# EasyEDA Pro project 二版平衡车pcb.epro, board PCB4
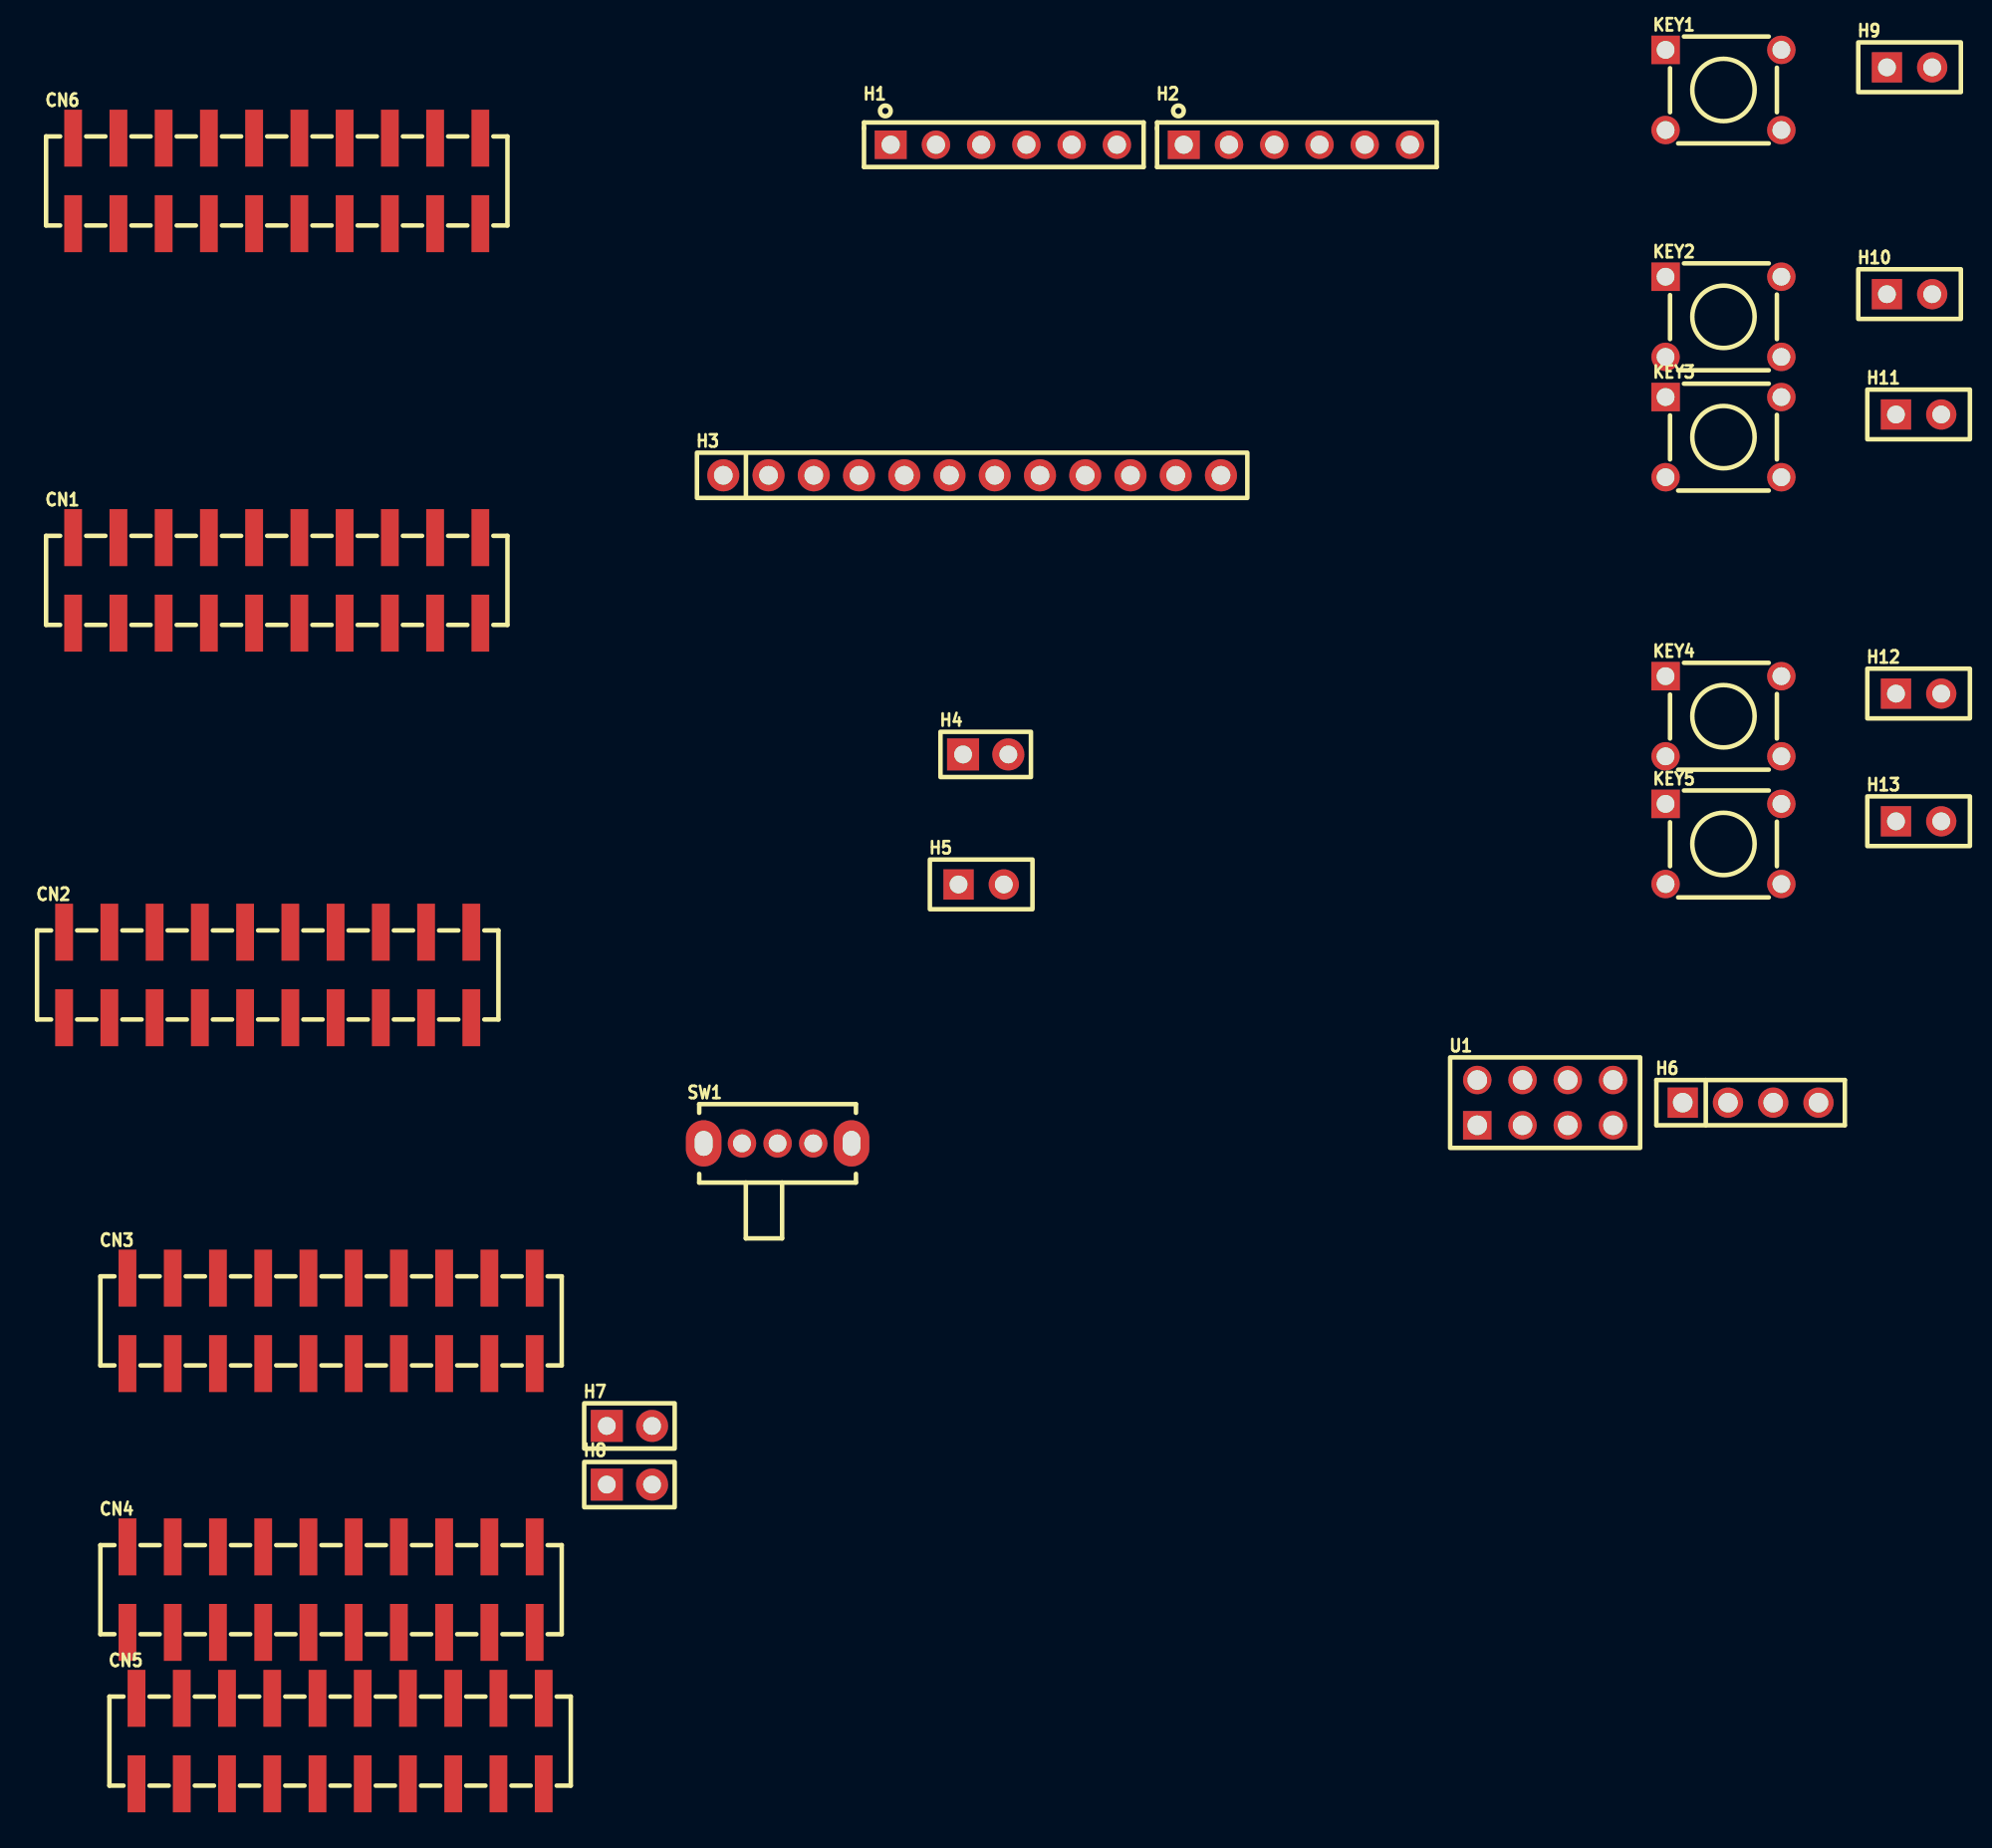
[diagram p8: board, top side]
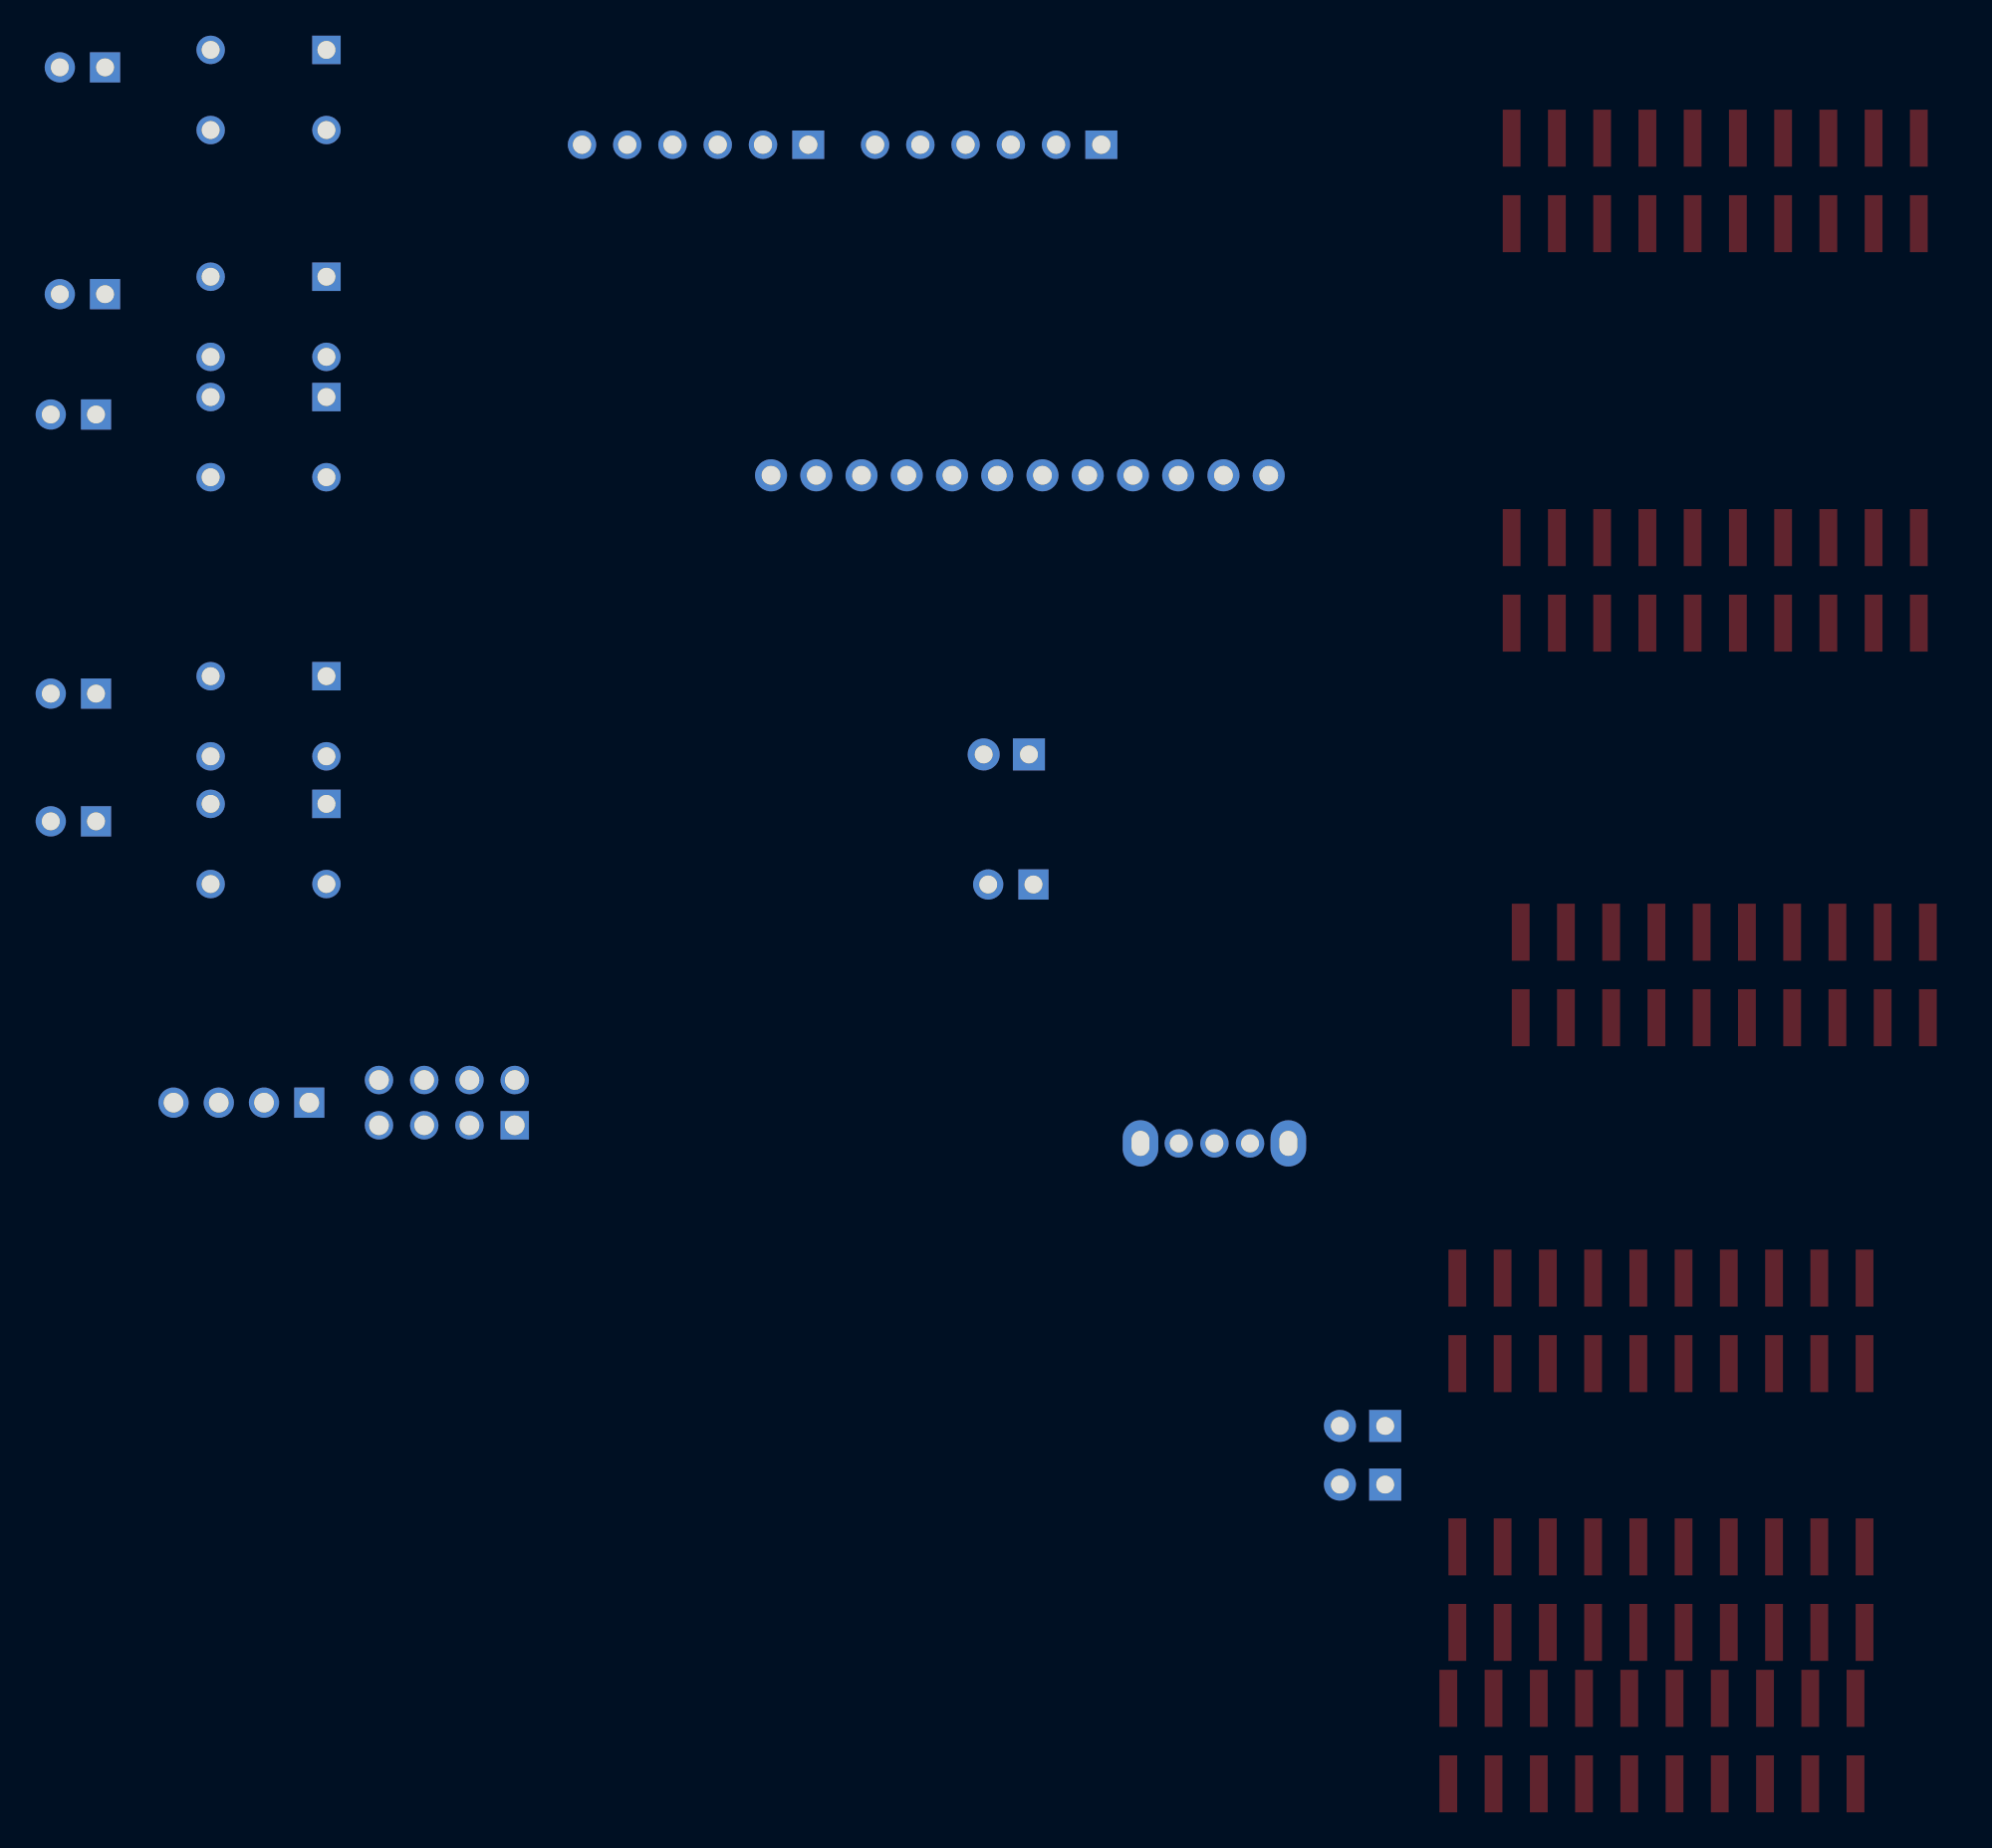
[diagram p9: board, bottom side, seen from below]

No outline. copper layers: Top Layer, Bottom Layer. Coordinates in mm from the lowest, leftmost part position.
Stack: Top Layer 0.035mm / Dielectric1 1.51mm FR4 er 4.5 / Bottom Layer 0.035mm

## Design rules (mm)
template: JLCPCB Capability(Two Layers Board)
spacing copperThickness1oz (default): track to track 0.102, other pairs 0.152 to 0.3
spacing copperThickness2oz: track to track 0.203, other pairs 0.152 to 0.3
track width copperThickness1oz (default): min 0.127, default 0.254, max 2.54
track width copperThickness2oz: min 0.203, default 0.254, max 2.54
differential pair differentialPair (default): width min 0.127, default 0.254, max 2.54; gap min 0.152, default 0.152
via viaSize (default): diameter min 0.5, default 0.61, max 10; hole min 0.3, default 0.305, max 6.3

## Placement (name value [footprint] x y rotation side)
CN1  PM254-2-10-S-8.5  [HDR-SMD_20P-P2.54-V-F-R2-C10-S2.54-LS7.1]  0.51 65.15 0 top
CN2  PM254-2-10-S-8.5  [HDR-SMD_20P-P2.54-V-F-R2-C10-S2.54-LS7.1]  0 43 0 top
CN3  PM254-2-10-S-8.5  [HDR-SMD_20P-P2.54-V-F-R2-C10-S2.54-LS7.1]  3.56 23.59 0 top
CN4  PM254-2-10-S-8.5  [HDR-SMD_20P-P2.54-V-F-R2-C10-S2.54-LS7.1]  3.56 8.5 0 top
CN5  PM254-2-10-S-8.5  [HDR-SMD_20P-P2.54-V-F-R2-C10-S2.54-LS7.1]  4.06 0 0 top
CN6  PM254-2-10-S-8.5  [HDR-SMD_20P-P2.54-V-F-R2-C10-S2.54-LS7.1]  0.51 87.58 0 top
H1  -  [HDR-TH_6P-P2.54-V-F]  41.32 89.61 0 top
H2  -  [HDR-TH_6P-P2.54-V-F]  57.78 89.61 0 top
H3  -  [HDR-TH_12P-P2.54-V-F]  39.55 71.05 0 top
H4  -  [HDR-TH_2P-P2.54-V-M-1]  40.31 55.38 0 top
H5  -  [HDR-TH_2P-P2.54-V-F]  40.06 48.08 0 top
H6  -  [HDR-TH_4P-P2.54-V-F]  83.25 35.84 0 top
H7  -  [HDR-TH_2P-P2.54-V-M-1]  20.31 17.69 0 top
H8  -  [HDR-TH_2P-P2.54-V-M-1]  20.31 14.4 0 top
H9  -  [HDR-TH_2P-P2.54-V-F]  92.18 93.95 0 top
H10  -  [HDR-TH_2P-P2.54-V-F]  92.18 81.22 0 top
H11  -  [HDR-TH_2P-P2.54-V-F]  92.68 74.46 0 top
H12  -  [HDR-TH_2P-P2.54-V-F]  92.68 58.8 0 top
H13  -  [HDR-TH_2P-P2.54-V-F]  92.68 51.63 0 top
KEY1  AN6*6  [KEY-TH_4P-L6.0-W6.0-P6.50-LS4.5]  81.73 92.68 0 top
KEY2  AN6*6  [KEY-TH_4P-L6.0-W6.0-P6.50-LS4.5]  81.73 79.95 0 top
KEY3  AN6*6  [KEY-TH_4P-L6.0-W6.0-P6.50-LS4.5]  81.73 73.19 0 top
KEY4  AN6*6  [KEY-TH_4P-L6.0-W6.0-P6.50-LS4.5]  81.73 57.53 0 top
KEY5  AN6*6  [KEY-TH_4P-L6.0-W6.0-P6.50-LS4.5]  81.73 50.36 0 top
SW1  SK12D07VG3  [SW-TH_SK12D07VG3]  28.62 33.55 0 top
U1  2.54-2*4  [HDR-TH_8P-P2.54-V-F-R2-C4-S2.54]  71.72 35.84 0 top

## Footprints (pads in the part's own frame, mm; a bottom-side part is the same pattern mirrored in y, then rotated)
HDR-SMD_20P-P2.54-V-F-R2-C10-S2.54-LS7.1
  rect 1x3.2 smd: 1(-11.43,-2.4) 2(-11.43,2.4) 3(-8.89,-2.4) 4(-8.89,2.4) 5(-6.35,-2.4) 6(-6.35,2.4) 7(-3.81,-2.4) 8(-3.81,2.4) 9(-1.27,-2.4) 10(-1.27,2.4) 11(1.27,-2.4) 12(1.27,2.4) 13(3.81,-2.4) 14(3.81,2.4) 15(6.35,-2.4) 16(6.35,2.4) 17(8.89,-2.4) 18(8.89,2.4) 19(11.43,-2.4) 20(11.43,2.4)
HDR-TH_2P-P2.54-V-F
  rect 1.7x1.7 hole 1: 1(-1.27,0)
  round 1.7 hole 1: 2(1.27,0)
HDR-TH_2P-P2.54-V-M-1
  rect 1.8x1.8 hole 1: 1(-1.27,0)
  round 1.8 hole 1: 2(1.27,0)
HDR-TH_4P-P2.54-V-F
  rect 1.7x1.7 hole 1.1: 1(-3.81,0)
  round 1.7 hole 1.1: 2(-1.27,0) 3(1.27,0) 4(3.81,0)
HDR-TH_6P-P2.54-V-F
  rect 1.8x1.6 hole 1.02: 1(-6.35,0)
  round 1.6 hole 1.02: 2(-3.81,0) 3(-1.27,0) 4(1.27,0) 5(3.81,0) 6(6.35,0)
HDR-TH_8P-P2.54-V-F-R2-C4-S2.54
  rect 1.6x1.6 hole 1.1: 1(-3.81,-1.27)
  round 1.6 hole 1.1: 2(-3.81,1.27) 3(-1.27,-1.27) 4(-1.27,1.27) 5(1.27,-1.27) 6(1.27,1.27) 7(3.81,-1.27) 8(3.81,1.27)
HDR-TH_12P-P2.54-V-F
  round 1.8 hole 1.05: 1(-13.97,0) 2(-11.43,0) 3(-8.89,0) 4(-6.35,0) 5(-3.81,0) 6(-1.27,0) 7(1.27,0) 8(3.81,0) 9(6.35,0) 10(8.89,0) 11(11.43,0) 12(13.97,0)
KEY-TH_4P-L6.0-W6.0-P6.50-LS4.5
  rect 1.6x1.6 hole 1: 1(-3.25,2.25)
  round 1.6 hole 1: 2(3.25,2.25) 3(-3.25,-2.25) 4(3.25,-2.25)
SW-TH_SK12D07VG3
  oval 1.6x1.6 hole 1: 1(-2,0) 2(0,0) 3(2,0)
  oval 2x2.6 hole 1x1.4: 4(4.15,0) 5(-4.15,0)

## Nets
As in the schematic.

Pads without a net: H1 1 6; H2 1 2 3 4 5 6; H3 3 4 5 6 7 8 9; H6 1 2 3 4; KEY1 1 4; KEY2 1 4; KEY3 1 4; KEY4 1 4; KEY5 1 4; SW1 1 4 5; U1 1 2 3 4 5 6 7 8
